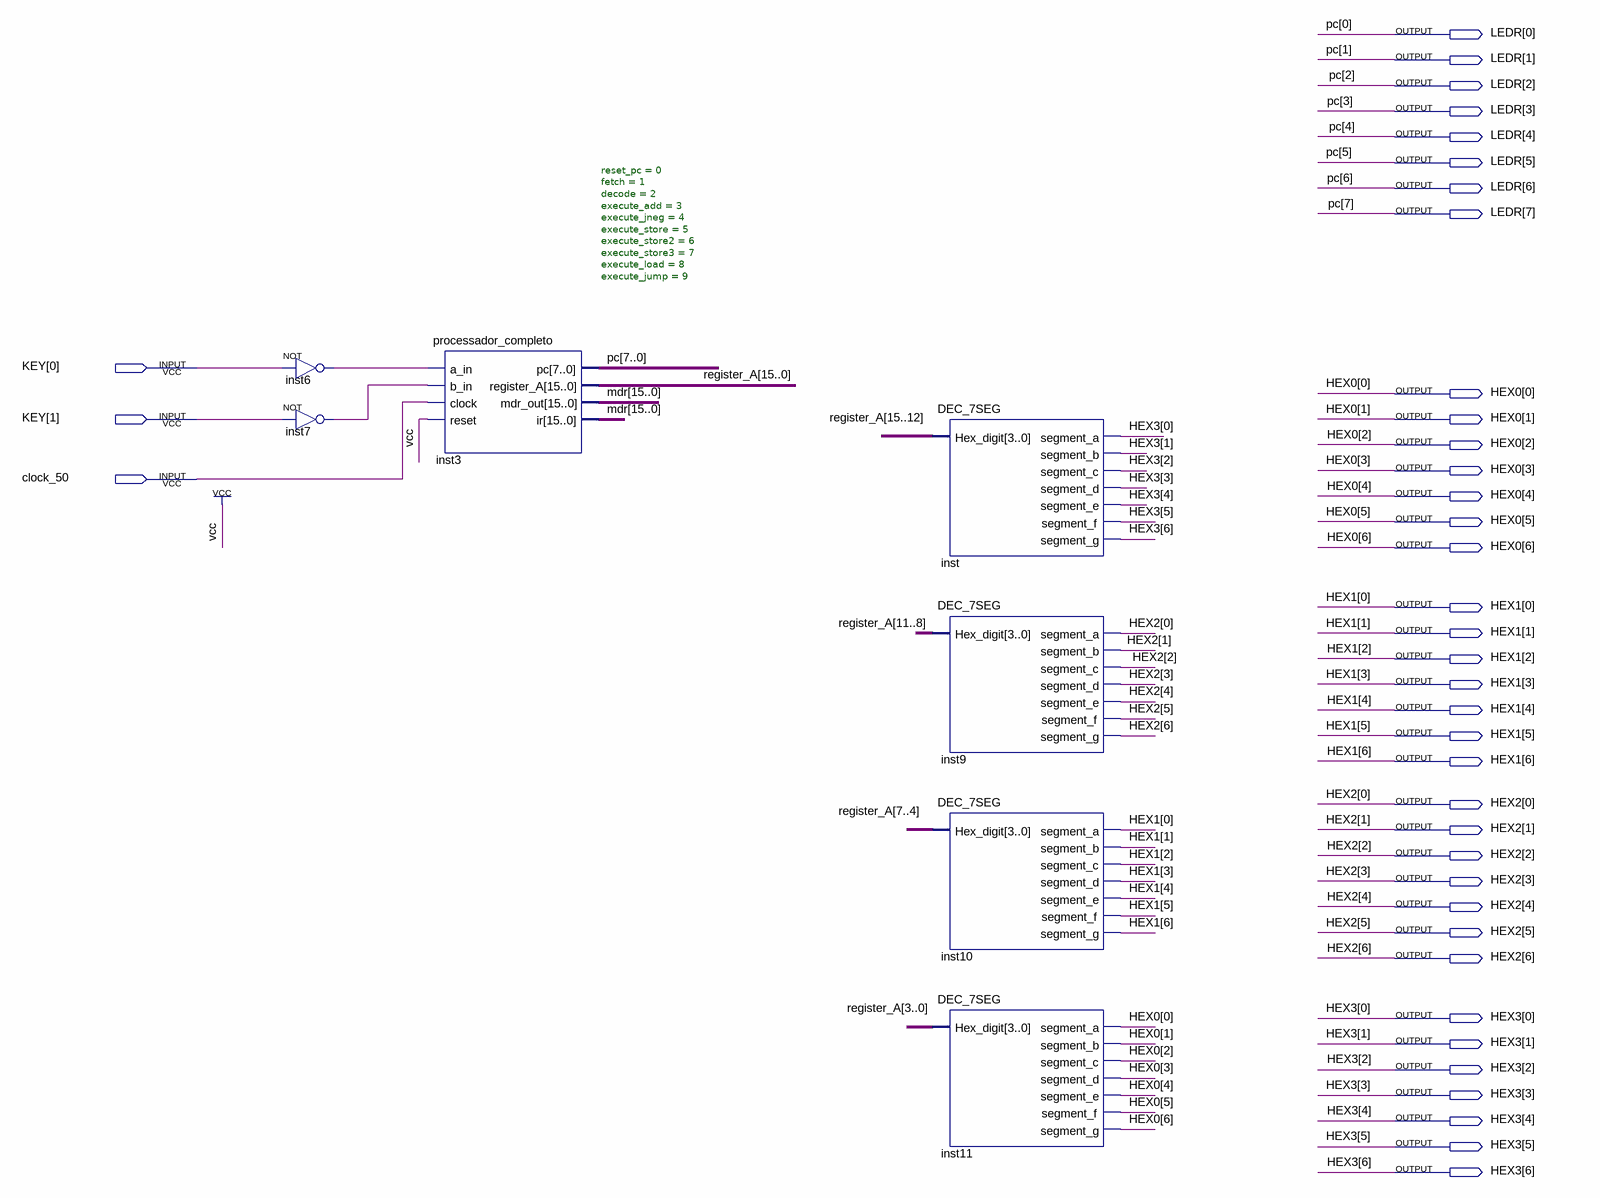
[diagram p0: schematic sheet]
// Quartus schematic Block1.bdf as structural Verilog: 7 symbols, 39 pins
module Block1 (
  input  [1:0] KEY,
  input  clock_50,
  output [7:0] LEDR,
  output [6:0] HEX0,
  output [6:0] HEX1,
  output [6:0] HEX2,
  output [6:0] HEX3
);

  wire inst6_out, inst7_out;
  wire [15:0] mdr, register_A;

  not inst6 (inst6_out, KEY[0]);
  not inst7 (inst7_out, KEY[1]);
  processador_completo #(.reset_pc(0), .fetch(1), .decode(2), .execute_add(3), .execute_jneg(4), .execute_store(5), .execute_store2(6), .execute_store3(7), .execute_load(8), .execute_jump(9)) inst3 (
    .a_in(inst6_out), .b_in(inst7_out), .clock(clock_50), .reset(1'b1), .pc(LEDR), .register_A(register_A),
    .mdr_out(mdr), .ir(mdr));
  DEC_7SEG inst (
    .Hex_digit(register_A[15:12]), .segment_a(HEX3[0]), .segment_b(HEX3[1]), .segment_c(HEX3[2]),
    .segment_d(HEX3[3]), .segment_e(HEX3[4]), .segment_f(HEX3[5]), .segment_g(HEX3[6]));
  DEC_7SEG inst9 (
    .Hex_digit(register_A[11:8]), .segment_a(HEX2[0]), .segment_b(HEX2[1]), .segment_c(HEX2[2]),
    .segment_d(HEX2[3]), .segment_e(HEX2[4]), .segment_f(HEX2[5]), .segment_g(HEX2[6]));
  DEC_7SEG inst10 (
    .Hex_digit(register_A[7:4]), .segment_a(HEX1[0]), .segment_b(HEX1[1]), .segment_c(HEX1[2]),
    .segment_d(HEX1[3]), .segment_e(HEX1[4]), .segment_f(HEX1[5]), .segment_g(HEX1[6]));
  DEC_7SEG inst11 (
    .Hex_digit(register_A[3:0]), .segment_a(HEX0[0]), .segment_b(HEX0[1]), .segment_c(HEX0[2]),
    .segment_d(HEX0[3]), .segment_e(HEX0[4]), .segment_f(HEX0[5]), .segment_g(HEX0[6]));

  // Other names for the same wires on the sheet: pc[7:0] = LEDR
endmodule
